# EAGLE design MFOS Dual VCA 2Layer (EAGLE 7.6.0)
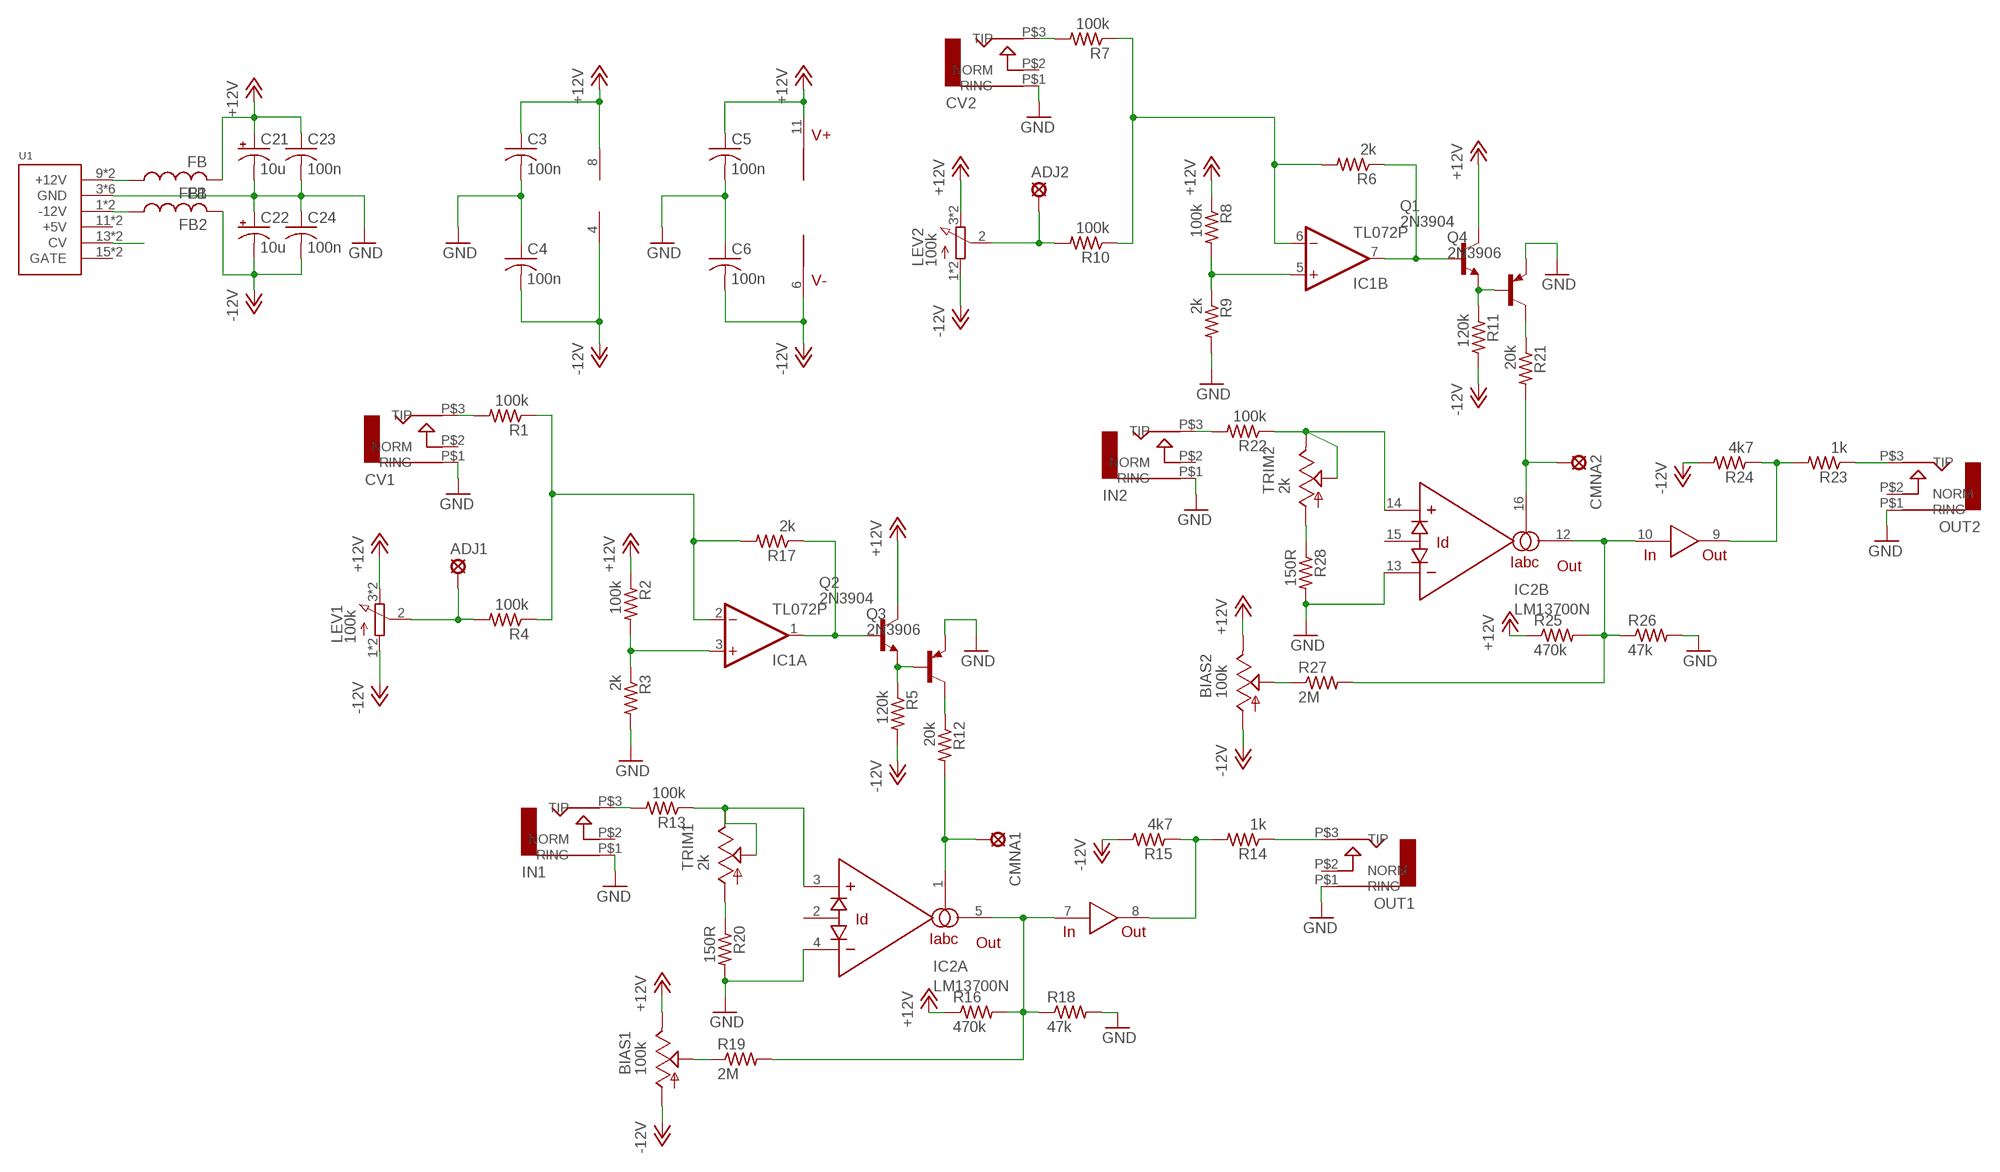
[diagram p0: schematic, sheet 1]

## Parts
ADJ1  LSP10  [LSP10]
ADJ2  LSP10  [LSP10]
BIAS1  100k  TRIM_US-B64W  [B64W]
BIAS2  100k  TRIM_US-B64W  [B64W]
C3  100n  C-USC1206  [C1206]
C4  100n  C-USC1206  [C1206]
C5  100n  C-USC1206  [C1206]
C6  100n  C-USC1206  [C1206]
C21  10u  CPOL-USB45181A  [B45181A]
C22  10u  CPOL-USB45181A  [B45181A]
C23  100n  C-US050-024X044  [C050-024X044]
C24  100n  C-US050-024X044  [C050-024X044]
CMNA1  LSP10  [LSP10]
CMNA2  LSP10  [LSP10]
CV1  AUDIO-JACKITEAD  [JACK-90DEG-ITEAD]
CV2  AUDIO-JACKITEAD  [JACK-90DEG-ITEAD]
FB1  FB  [FB]
FB2  FB  [FB]
IC1  TL072P  [DIL08]
IC2  LM13700N  [DIL16]
IN1  AUDIO-JACKITEAD  [JACK-90DEG-ITEAD]
IN2  AUDIO-JACKITEAD  [JACK-90DEG-ITEAD]
LEV1  100k  3RP/1610N  [3RP/1610N]
LEV2  100k  3RP/1610N  [3RP/1610N]
OUT1  AUDIO-JACKITEAD  [JACK-90DEG-ITEAD]
OUT2  AUDIO-JACKITEAD  [JACK-90DEG-ITEAD]
Q1  2N3904  [TO92]
Q2  2N3904  [TO92]
Q3  2N3906  [TO92]
Q4  2N3906  [TO92]
R1  100k  R-US_0207/7  [0207/7]
R2  100k  R-US_0207/7  [0207/7]
R3  2k  R-US_0207/7  [0207/7]
R4  100k  R-US_0207/7  [0207/7]
R5  120k  R-US_0207/7  [0207/7]
R6  2k  R-US_0207/7  [0207/7]
R7  100k  R-US_0207/7  [0207/7]
R8  100k  R-US_0207/7  [0207/7]
R9  2k  R-US_0207/7  [0207/7]
R10  100k  R-US_0207/7  [0207/7]
R11  120k  R-US_0207/7  [0207/7]
R12  20k  R-US_0207/7  [0207/7]
R13  100k  R-US_0207/7  [0207/7]
R14  1k  R-US_0207/7  [0207/7]
R15  4k7  R-US_0207/7  [0207/7]
R16  470k  R-US_0207/7  [0207/7]
R17  2k  R-US_0207/7  [0207/7]
R18  47k  R-US_0207/7  [0207/7]
R19  2M  R-US_0207/7  [0207/7]
R20  150R  R-US_0207/7  [0207/7]
R21  20k  R-US_0207/7  [0207/7]
R22  100k  R-US_0207/7  [0207/7]
R23  1k  R-US_0207/7  [0207/7]
R24  4k7  R-US_0207/7  [0207/7]
R25  470k  R-US_0207/7  [0207/7]
R26  47k  R-US_0207/7  [0207/7]
R27  2M  R-US_0207/7  [0207/7]
R28  150R  R-US_0207/7  [0207/7]
TRIM1  2k  TRIM_US-B64W  [B64W]
TRIM2  2k  TRIM_US-B64W  [B64W]
U1  POWER  [POWER_16]

## Nets
+12V: BIAS1.E BIAS2.E C3.1 C5.1 C21.+ C23.1 FB1.P$2 IC1.8(P:V+) IC2.11(V+) LEV1.3(E) LEV1.6(E) LEV2.3(E) LEV2.6(E) Q1.1(C) Q2.1(C) R2.1 R8.1 R16.1 R25.1
-12V: BIAS1.A BIAS2.A C4.2 C6.2 C22.- C24.2 FB2.P$2 IC1.4(P:V-) IC2.6(V-) LEV1.1(A) LEV1.4(A) LEV2.1(A) LEV2.4(A) R5.2 R11.2 R15.2 R24.2
GND: C3.2 C4.1 C5.2 C6.1 C21.- C22.+ C23.2 C24.1 CV1.P$1(RING) CV2.P$1(RING) IC2.4(A:-IN) IC2.13(B:-IN) IN1.P$1(RING) IN2.P$1(RING) OUT1.P$1(RING) OUT2.P$1(RING) Q3.3(E) Q4.3(E) R3.2 R9.2 R18.2 R20.2 R26.2 R28.2 U1.3(GND) U1.4(GND) U1.5(GND) U1.6(GND) U1.7(GND) U1.8(GND)
N$1: IC1.7(B:OUT) Q1.2(B) R6.1
N$2: IC1.5(B:+IN) R8.2 R9.1
N$3: CV1.P$3(TIP) R1.2
N$4: CV2.P$3(TIP) R7.2
N$5: ADJ1.MP LEV1.2(S) R4.2
N$6: IC1.2(A:-IN) R1.1 R4.1 R17.2
N$7: Q2.3(E) Q3.2(B) R5.1
N$8: IC1.1(A:OUT) Q2.2(B) R17.1
N$9: ADJ2.MP LEV2.2(S) R10.2
N$10: IC1.6(B:-IN) R6.2 R7.1 R10.1
N$11: IC1.3(A:+IN) R2.2 R3.1
N$12: Q3.1(C) R12.1
N$13: IN1.P$3(TIP) R13.2
N$14: Q1.3(E) Q4.2(B) R11.1
N$15: Q4.1(C) R21.1
N$16: CMNA1.MP IC2.1(A:IABC) R12.2
N$17: IN2.P$3(TIP) R22.2
N$18: BIAS1.P$1(S) BIAS1.S R19.1
N$19: OUT1.P$3(TIP) R14.1
N$20: IC2.8(OUT) R14.2 R15.1
N$21: IC2.5(A:OUT) IC2.7(IN) R16.2 R18.1 R19.2
N$22: R20.1 TRIM1.A
N$23: IC2.3(A:+IN) R13.1 TRIM1.E TRIM1.P$1(S) TRIM1.S
N$24: CMNA2.MP IC2.16(B:IABC) R21.2
N$25: IC2.9(OUT) R23.2 R24.1
N$26: OUT2.P$3(TIP) R23.1
N$27: IC2.10(IN) IC2.12(B:OUT) R25.2 R26.1 R27.2
N$28: BIAS2.P$1(S) BIAS2.S R27.1
N$29: R28.1 TRIM2.A
N$30: IC2.14(B:+IN) R22.1 TRIM2.E TRIM2.P$1(S) TRIM2.S
N$55: U1.13(CV) U1.14(CV)
N$61: FB1.P$1 U1.9(+12V) U1.10(+12V)
N$62: FB2.P$1 U1.1(-12V) U1.2(-12V)
Unconnected: CV1.P$2(NORM) CV2.P$2(NORM) IC2.2(A:ID) IC2.15(B:ID) IN1.P$2(NORM) IN2.P$2(NORM) OUT1.P$2(NORM) OUT2.P$2(NORM) U1.11(+5V) U1.12(+5V) U1.15(GATE) U1.16(GATE)

## Library data of the parts
ADJ1 ADJ2 CMNA1 CMNA2 = solpad:LSP10: SOLDER PAD drill 1.0 mm, distributor Buerklin, 12H555
BIAS1 BIAS2 TRIM1 TRIM2 = pot:TRIM_US-: POTENTIOMETER
C3-C6 C23 C24 = rcl:C-US: CAPACITOR, American symbol
C21 C22 = rcl:CPOL-US: POLARIZED CAPACITOR, American symbol
CV1 CV2 IN1 IN2 OUT1 OUT2 = erthenvar:AUDIO-JACK: Switching Mono 3.5mm Audio Jack from Erthenvar.
FB1 FB2 = adafruit:FB: Ferrite bead Digikey #P9821BK-ND
IC1 = linear:TL072: OP AMP
IC2 = synthdiy updated imperial:LM13700: National Dual OTA with buffers.
LEV1 LEV2 = pot:3RP/1610N: 16mm Potentiometer one level Source: http://www.alphapotentiometers.net/html/16mm_pot_2.html
Q1 Q2 = transistor-npn:2N3904: NPN Transistor
Q3 Q4 = transistor-pnp:2N3906: PNP Transistor
R1-R28 = rcl:R-US_: RESISTOR, American symbol
U1 = eurorack:POWER

## Board
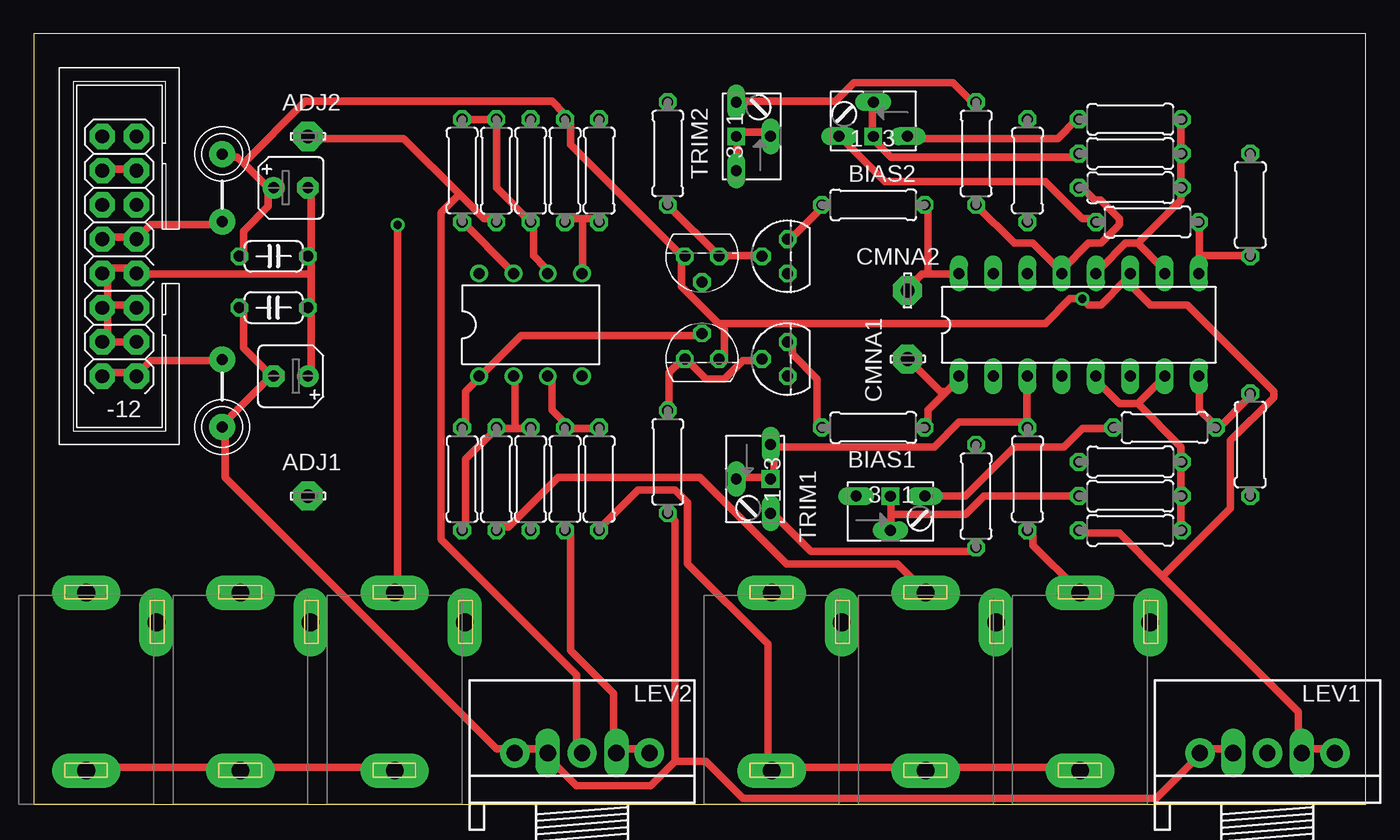
[diagram p1: board, top side]
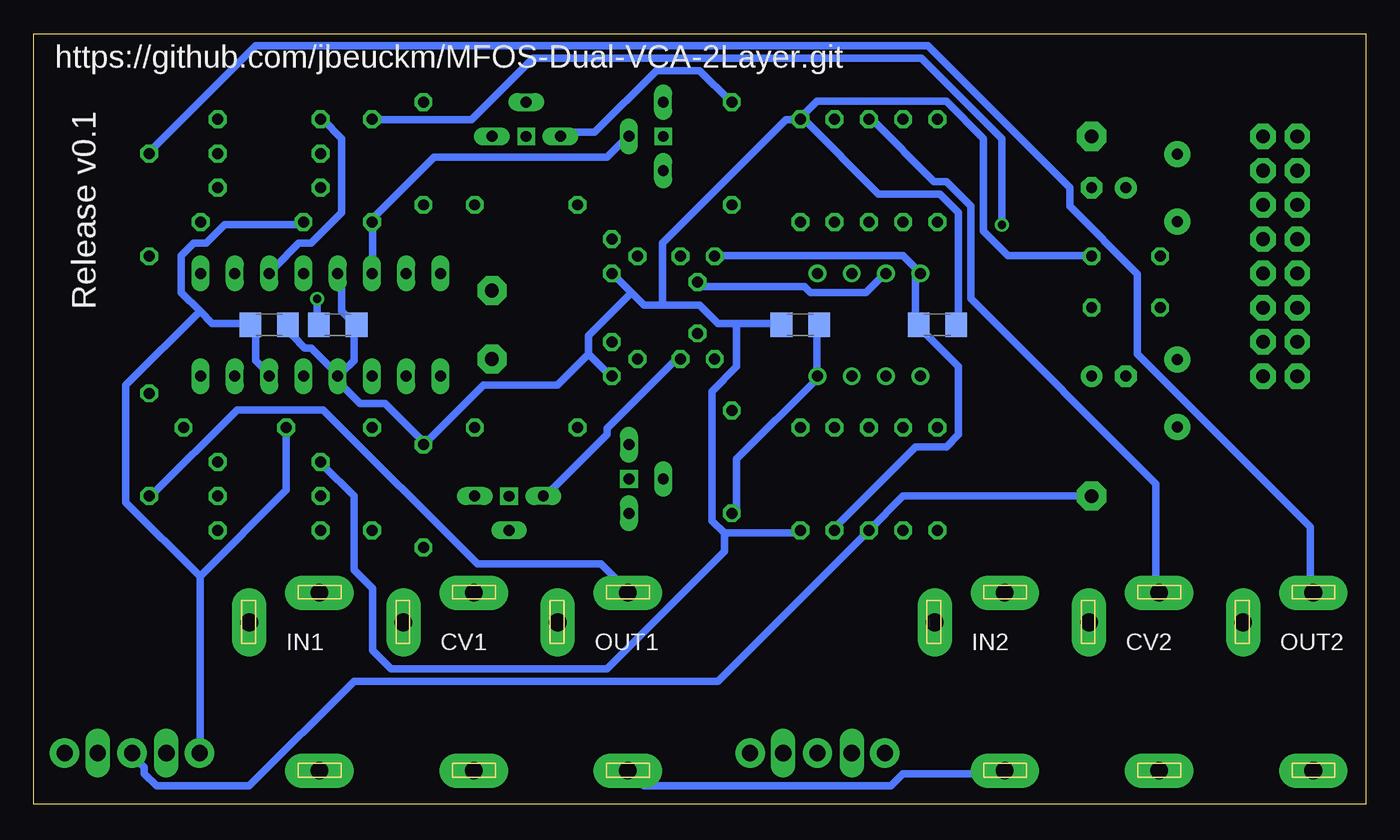
[diagram p2: board, bottom side, seen from below]

Size 98.73 x 57.14 mm. Coordinates in mm from the lower left corner, seen from the top.
Outline: 0,0 98.73,0 98.73,57.14 0,57.14 0,0
Copper layers (1*16): Top 0.035mm / dielectric 1.5mm / Bottom 0.035mm
Design rules "default *": minimum track width 22mil, minimum drill 24mil, track to track 14mil, track to pad 14mil, pad to pad 14mil, via to via 14mil, smd to smd 14mil, copper to edge 0mil, drill to drill 14mil, minimum pad ring 10mil, minimum via ring 8mil, stop-mask expansion 4mil, vias tented up to drill 0mil, thermal gap 10mil

### Footprints (pad centres in the part's own frame; a part is rotated, then mirrored left to right if it is on the bottom)
LSP10 = drill 1.016 pad 2.159 octagon: MP 0,0
B64W = drill 0.813 long: A 2.54,0; E -2.54,0; S 0,-2.54 | drill 0.8 square: P$1 0,0
C1206 = smd 1.6 x 1.8: 1 -1.4,0; 2 1.4,0
B45181A = drill 0.813 pad 1.6: + -1.27,0 | drill 0.813 pad 1.6 octagon: - 1.27,0
C050-024X044 = drill 0.813 octagon: 1 -2.54,0; 2 2.54,0
JACK-90DEG-ITEAD = drill 1.3 pad 2.54 long: P$1 5,-2.5; P$2 -0.2,-13.5; P$3 5,-15.7
FB = drill 0.8 pad 1.93: P$1 -2.5,0; P$2 2.5,0
DIL08 = drill 0.813 pad 1.27: 1 -3.81,-3.81; 2 -1.27,-3.81; 3 1.27,-3.81; 4 3.81,-3.81; 5 3.81,3.81; 6 1.27,3.81; 7 -1.27,3.81; 8 -3.81,3.81
DIL16 = drill 0.813 long: 1 -8.89,-3.81; 2 -6.35,-3.81; 3 -3.81,-3.81; 4 -1.27,-3.81; 5 1.27,-3.81; 6 3.81,-3.81; 7 6.35,-3.81; 8 8.89,-3.81; 9 8.89,3.81; 10 6.35,3.81; 11 3.81,3.81; 12 1.27,3.81; 13 -1.27,3.81; 14 -3.81,3.81; 15 -6.35,3.81; 16 -8.89,3.81
3RP/1610N = drill 1.2 pad 2.184: 1 -5,0; 2 0,0; 3 5,0 | drill 1.2 long: 4 -2.54,0; 6 2.54,0
TO92 = drill 0.813 octagon: 1 1.27,0; 2 0,1.905; 3 -1.27,0
0207/7 = drill 0.813 octagon: 1 -3.81,0; 2 3.81,0
POWER_16 = drill 1.016 pad 1.88 octagon: 1 -6.35,-1.27; 2 -6.35,1.27; 3 -3.81,-1.27; 4 -3.81,1.27; 5 -1.27,-1.27; 6 -1.27,1.27; 7 1.27,-1.27; 8 1.27,1.27; 9 3.81,-1.27; 10 3.81,1.27; 11 6.35,-1.27; 12 6.35,1.27; 13 8.89,-1.27; 14 8.89,1.27; 15 11.43,-1.27; 16 11.43,1.27

### Placement (x,y rotation side)
ADJ1  20.32,22.86 0 top
ADJ2  20.32,49.53 0 top
BIAS1  63.5,22.86 0 top
BIAS2  62.23,49.53 180 top
C3  31.75,35.56 0 bottom
C4  41.91,35.56 0 bottom
C5  76.2,35.56 0 bottom
C6  81.28,35.56 180 bottom
C21  19.05,45.72 0 top
C22  19.05,31.75 180 top
C23  17.78,40.64 0 top
C24  17.78,36.83 180 top
CMNA1  64.77,33.02 0 top
CMNA2  64.77,38.1 270 top
CV1  71.12,0 180 top
CV2  20.32,0 180 top
FB1  13.97,45.72 90 top
FB2  13.97,30.48 270 top
IC1  36.83,35.56 0 top
IC2  77.47,35.56 0 top
IN1  82.55,0 180 top
IN2  31.75,0 180 top
LEV1  91.44,3.81 0 top
LEV2  40.64,3.81 0 top
OUT1  59.69,0 180 top
OUT2  8.89,0 180 top
Q1  49.53,40.64 180 top
Q2  49.53,33.02 0 top
Q3  55.88,33.02 90 top
Q4  55.88,40.64 90 top
R1  34.29,24.13 270 top
R2  39.37,24.13 90 top
R3  41.91,24.13 270 top
R4  36.83,24.13 270 top
R5  46.99,25.4 270 top
R6  31.75,46.99 90 top
R7  36.83,46.99 90 top
R8  39.37,46.99 270 top
R9  41.91,46.99 90 top
R10  34.29,46.99 270 top
R11  46.99,48.26 90 top
R12  62.23,27.94 0 top
R13  73.66,24.13 270 top
R14  90.17,26.67 90 top
R15  83.82,27.94 180 top
R16  81.28,20.32 0 top
R17  31.75,24.13 270 top
R18  81.28,25.4 180 top
R19  81.28,22.86 0 top
R20  69.85,22.86 90 top
R21  62.23,44.45 0 top
R22  73.66,46.99 90 top
R23  90.17,44.45 270 top
R24  82.55,43.18 180 top
R25  81.28,50.8 0 top
R26  81.28,45.72 180 top
R27  81.28,48.26 0 top
R28  69.85,48.26 270 top
TRIM1  54.61,24.13 270 top
TRIM2  52.07,49.53 90 top
U1  6.35,38.1 90 top

### Tracks (layer width: path | path; a pad name or v marks a point on that pad's centre or on a via)
+12V  (via drill 0.61)
  Top 0.559: 83.67,16.92 93.73,6.86 93.73,4.12 LEV1.6 94.18,4.12 96.01,4.12 LEV1.3 | 83.67,16.92 80.47,20.12 77.72,20.12 R16.1 | 80.92,38.86 81.38,39.32 IC2.11 80.92,38.86 | 80.92,38.86 79.1,37.03 78.18,37.03 v77.72,37.49 76.81,37.49 74.98,35.66 50.75,35.66 | BIAS2.E 64.92,49.38 75.89,49.38 77.27,50.75 R25.1 | R2.1 39.78,20.12 39.78,11.43 42.98,8.23 42.98,4.12 LEV2.6 43.43,4.12 45.26,4.12 LEV2.3 | 17.37,45.72 17.37,44.35 15.54,42.52 15.54,40.69 C23.1 | 17.37,45.72 15.54,47.55 | 15.54,47.55 15.09,48.01 14.17,48.01 FB1.P$2 | 17.37,45.72 C21.+ | 50.75,35.66 51.21,35.2 51.21,33.38 Q2.1 | 50.75,35.66 48.01,38.41 48.01,40.23 Q1.1 48.01,40.69 39.78,48.92 39.78,50.75 R8.1 39.32,51.21 38.41,52.12 20.12,52.12 15.54,47.55 | 83.67,16.92 88.7,21.95 88.7,26.98 91.9,30.18 91.9,30.63 85.5,37.03 82.75,37.03 80.92,38.86
  Bottom 0.559: v77.72,37.49 77.72,35.66 C5.1 | IC2.11 80.92,39.78 79.1,41.6 78.18,41.6 75.89,43.89 75.89,49.38 77.27,50.75 R25.1 | BIAS1.E 60.81,22.86 56.24,27.43 56.24,27.89 51.21,32.92 Q2.1 | Q1.1 48.01,40.69 34.29,40.69 33.38,39.78 IC1.8 33.38,39.32 33.38,35.66 C3.1 32.92,35.2 30.18,32.46 30.18,27.43 31.09,26.52 33.38,26.52 39.32,20.57 R2.1
-12V
  Top 0.559: C24.2 15.54,36.58 15.54,33.83 17.37,32 C22.- 17.37,31.55 14.17,28.35 FB2.P$2 14.17,27.89 14.17,24.23 34.29,4.12 35.2,4.12 LEV2.1 35.66,4.12 37.95,4.12 LEV2.4 38.41,3.66 38.41,3.2 40.23,1.37 45.72,1.37 47.55,3.2 | 47.55,3.2 47.55,21.03 R5.2 | LEV1.4 88.7,4.12 86.87,4.12 LEV1.1 86.41,3.66 83.21,0.46 52.58,0.46 49.84,3.2 47.55,3.2 | BIAS1.A 69.04,22.86 72.69,26.52 76.35,26.52 77.72,27.89 80.01,27.89 R15.2 | BIAS2.A 59.89,49.38 63.09,46.18 74.98,46.18 77.72,43.43 78.64,43.43 R24.2
  Bottom 0.559: C4.2 40.69,35.2 40.69,32 IC1.4 40.69,31.55 46.63,25.6 46.63,21.95 R5.2 | 86.41,16.92 86.41,4.12 LEV1.1 | 86.41,16.92 80.01,23.32 R15.2 | BIAS2.A 59.44,49.84 57.15,49.84 52.58,54.41 49.38,54.41 47.09,52.12 R11.2 | IC2.6 81.38,32 82.3,32.92 82.3,35.2 C6.2 82.75,35.66 85.5,35.66 86.41,36.58 | 86.41,36.58 87.78,37.95 87.78,40.69 86.87,41.6 85.95,41.6 84.58,42.98 79.1,42.98 R24.2 | 86.41,16.92 91.9,22.4 91.9,31.09 86.41,36.58
GND
  Top 0.559: OUT2.P$1 4.12,2.74 15.09,2.74 CV2.P$1 15.54,2.74 26.52,2.74 IN2.P$1 | IN1.P$1 77.27,2.74 66.29,2.74 CV1.P$1 65.84,2.74 54.86,2.74 OUT1.P$1 54.41,2.74 54.41,11.89 48.46,17.83 48.46,22.4 47.55,23.32 44.81,23.32 42.06,20.57 R3.2 | U1.3 5.49,34.29 | 5.49,37.03 7.32,37.03 U1.5 | 5.49,34.29 5.49,36.58 U1.6 5.49,37.03 | 5.49,34.29 U1.4 | 5.49,37.03 5.49,39.32 U1.8 5.49,39.78 7.32,39.78 U1.7 7.77,39.32 20.57,39.32 | 20.57,39.32 20.57,40.23 C23.2 20.57,40.69 20.57,45.72 C21.- | 20.57,39.32 20.57,37.03 C24.1 20.57,36.58 20.57,32 C22.+ | R28.2 72.69,41.6 74.07,41.6 75.89,39.78 IC2.13 76.35,39.78 78.18,41.6 79.1,41.6 80.47,42.98 80.47,43.43 79.1,44.81 78.64,44.81 77.72,45.72 R26.2
  Bottom 0.559: IN2.P$1 26.98,2.29 34.29,2.29 35.2,1.37 53.49,1.37 54.41,2.29 OUT1.P$1 | IC2.4 75.89,32 74.98,32.92 74.98,35.2 C5.2 74.98,35.66 75.89,36.58 75.89,39.32 IC2.13 | C6.1 79.55,35.2 79.55,34.75 78.64,33.83 78.18,33.83 76.35,32 IC2.4 | IC2.4 76.35,31.55 74.52,29.72 72.69,29.72 69.95,26.98 R20.2 69.49,26.98 65.38,31.09 59.89,31.09 57.61,33.38 | C3.2 30.18,35.66 30.18,43.89 31.55,45.26 36.12,45.26 41.6,50.75 R9.2 | 46.63,35.66 48.01,35.66 49.38,37.03 52.12,37.03 | 46.63,35.66 43.43,35.66 C4.1 | 52.12,37.03 53.49,37.03 54.41,37.95 | 54.41,37.95 55.78,39.32 Q4.3 | 47.55,20.12 42.06,20.12 R3.2 | 47.55,20.12 48.46,21.03 48.46,30.63 46.63,32.46 46.63,35.66 | 47.55,20.12 47.55,18.75 56.24,10.06 72.24,10.06 73.61,11.43 73.61,16 74.98,17.37 74.98,22.86 77.27,25.15 R18.2 | 57.61,33.38 56.24,32 Q3.3 | 57.61,33.38 57.61,34.75 54.41,37.95 | 52.12,37.03 52.12,41.6 42.98,50.75 42.06,50.75 R9.2 | C23.2 20.57,40.69 26.52,40.69 28.35,42.52 28.35,49.38 31.09,52.12 40.69,52.12 41.6,51.21 R9.2
N$1
  Top 0.559: R6.1 32,42.98 35.2,39.78 IC1.7
  Bottom 0.559: Q1.2 49.38,38.41 41.6,38.41 41.15,37.95 37.03,37.95 35.66,39.32 IC1.7
N$2
  Top 0.559: 40.69,43.43 41.6,43.43 R9.1 | 40.69,43.43 39.78,43.43 R8.2 | 40.69,43.43 40.69,39.78 IC1.5
N$3
  Top 0.559: R1.2 34.29,20.57 35.2,20.57 38.86,24.23 49.38,24.23 55.78,17.83 64.01,17.83 65.84,16 CV1.P$3
N$4
  Bottom 0.559: R7.2 36.58,50.75 32,46.18 31.09,46.18 29.26,44.35 29.26,37.49 15.54,23.77 15.54,16 CV2.P$3
N$5
  Bottom 0.559: ADJ1.MP 34.29,22.86 R4.2 48.01,9.14 74.98,9.14 82.75,1.37 89.61,1.37 90.53,2.29 90.53,2.74 91.44,3.66 LEV1.2
N$6
  Top 0.559: 34.29,27.89 32,25.6 32,20.57 R17.2 | 34.29,27.89 35.66,27.89 | 35.66,27.89 36.58,27.89 R4.1 | 34.29,27.89 R1.1 | 35.66,27.89 35.66,31.55 IC1.2
N$7
  Top 0.559: R5.1 47.09,29.26 47.09,32 48.01,32.92 Q2.3 48.46,32.92 49.84,31.55 51.21,31.55 52.58,32.92 53.95,32.92 Q3.2
N$8
  Top 0.559: R17.1 32,28.35 32,30.63 32.92,31.55 IC1.1 33.38,32 36.12,34.75 49.38,34.75 Q2.2
N$9
  Top 0.559: 31.55,45.26 27.43,49.38 20.57,49.38 ADJ2.MP | 31.55,45.26 33.38,43.43 34.29,43.43 R10.2 | 31.55,45.26 30.18,43.89 30.18,19.66 40.23,9.6 40.23,4.12 LEV2.2
N$10
  Top 0.559: 34.29,50.75 32,50.75 R6.2 | IC1.6 37.95,39.78 37.03,40.69 37.03,42.98 R7.1 34.29,45.72 34.29,50.75 | 34.29,50.75 R10.1
N$11
  Top 0.559: R3.1 41.6,27.89 39.78,27.89 R2.2 39.32,28.35 38.41,29.26 38.41,31.55 IC1.3
N$12
  Top 0.559: Q3.1 56.24,34.29 56.24,33.38 58.06,31.55 58.06,28.35 R12.1
N$13
  Top 0.559: R13.2 74.07,20.12 74.07,19.2 77.27,16 IN1.P$3
N$14
  Top 0.559: Q4.2 53.95,40.69 51.21,40.69 Q1.3 R11.1
N$15
  Top 0.559: Q4.1 56.24,42.06 58.52,44.35 R21.1
N$16
  Top 0.559: 67.67,30.63 68.58,31.55 IC2.1 | 67.67,30.63 66.29,29.26 66.29,28.35 R12.2 | 67.67,30.63 67.21,30.63 64.92,32.92 CMNA1.MP
N$17  (via drill 0.61)
  Top 0.559: v26.98,42.98 26.98,16 IN2.P$3
  Bottom 0.559: v26.98,42.98 26.98,49.38 32.92,55.32 61.72,55.32 66.29,50.75 73.61,50.75 R22.2
N$18
  Top 0.559: 63.55,21.49 63.55,20.57 BIAS1.S | 63.55,21.49 63.55,22.86 BIAS1.P$1 | R19.1 70.41,22.86 69.04,21.49 63.55,21.49
N$19
  Bottom 0.559: R14.1 90.07,22.86 83.67,29.26 77.27,29.26 65.84,17.83 56.69,17.83 54.86,16 OUT1.P$3
N$20
  Top 0.559: IC2.8 86.41,31.55 86.41,29.26 87.33,28.35 R15.1 87.78,27.89 90.07,30.18 R14.2
N$21
  Top 0.559: 85.04,22.86 85.04,20.57 R16.2 | 85.04,22.86 85.04,25.15 R18.1 85.04,25.6 85.04,26.52 81.84,29.72 | 85.04,22.86 R19.2 | 81.84,29.72 80.47,29.72 79.1,31.09 79.1,31.55 IC2.5 | 81.84,29.72 83.67,31.55 IC2.7
N$22
  Top 0.559: R20.1 69.49,18.75 57.61,18.75 54.86,21.49 TRIM1.A
N$23
  Top 0.559: 73.61,28.35 73.61,31.55 IC2.3 | 54.86,26.52 54.86,24.23 TRIM1.P$1 54.41,24.23 52.12,24.23 TRIM1.S | 73.61,28.35 68.58,28.35 66.75,26.52 54.86,26.52 | 73.61,28.35 R13.1 | 54.86,26.52 TRIM1.E
N$24
  Top 0.559: 66.29,39.32 65.84,39.32 64.92,38.41 CMNA2.MP | 66.29,39.32 68.58,39.32 IC2.16 | 66.29,39.32 66.29,44.35 R21.2
N$25
  Top 0.559: 86.41,40.69 86.41,42.98 R24.1 | 86.41,40.69 86.41,39.78 IC2.9 | 86.41,40.69 90.07,40.69 R23.2
N$26
  Bottom 0.559: R23.1 90.07,48.46 82.3,56.24 32.46,56.24 21.95,45.72 21.95,44.35 16.92,39.32 16.92,33.38 4.12,20.57 4.12,16 OUT2.P$3
N$27
  Top 0.559: 85.04,45.72 85.04,48.01 R27.2 85.04,48.46 85.04,50.75 R25.2 | 81.84,41.6 80.92,41.6 79.1,39.78 IC2.12 | 81.84,41.6 83.67,39.78 IC2.10 | 85.04,45.72 85.04,44.81 81.84,41.6 | 85.04,45.72 R26.1
N$28
  Top 0.559: BIAS2.S 62.18,51.66 62.18,49.84 BIAS2.P$1 62.18,49.38 63.55,48.01 77.27,48.01 R27.1
N$29
  Top 0.559: TRIM2.A 52.12,52.12 59.44,52.12 60.81,53.49 68.12,53.49 69.49,52.12 R28.1
N$30
  Top 0.559: TRIM2.S 54.41,49.84 52.12,49.84 TRIM2.P$1 52.12,49.38 52.12,47.09 TRIM2.E
  Bottom 0.559: IC2.14 73.61,39.78 73.61,42.98 R22.1 73.61,43.43 69.04,48.01 56.24,48.01 54.86,49.38 TRIM2.S
N$55
  Top 0.559: U1.14 5.49,47.09 7.32,47.09 U1.13
N$61
  Top 0.559: U1.10 5.49,42.06 7.32,42.06 U1.9 8.69,42.98 13.72,42.98 FB1.P$1
N$62
  Top 0.559: U1.2 5.49,32 7.32,32 U1.1 7.77,32 8.69,32.92 13.72,32.92 FB2.P$1

### Text on the board
bNames: https://github.com/jbeuckm/MFOS-Dual-VCA-2Layer.git | Release v0.1